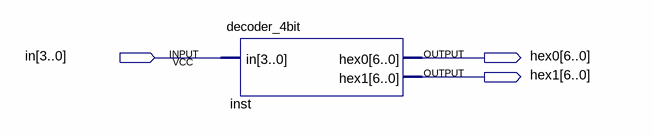
[diagram p0: schematic sheet]
// Quartus schematic Lab1_CE221.bdf as structural Verilog: 1 symbols, 3 pins
module Lab1_CE221 (
  input  [3:0] in,
  output [6:0] hex0,
  output [6:0] hex1
);

  decoder_4bit inst (.in(in), .hex0(hex0), .hex1(hex1));
endmodule
